# EAGLE design Olimex-MOD-TC-MK2-31855_rev_A1 (EAGLE 6.4)
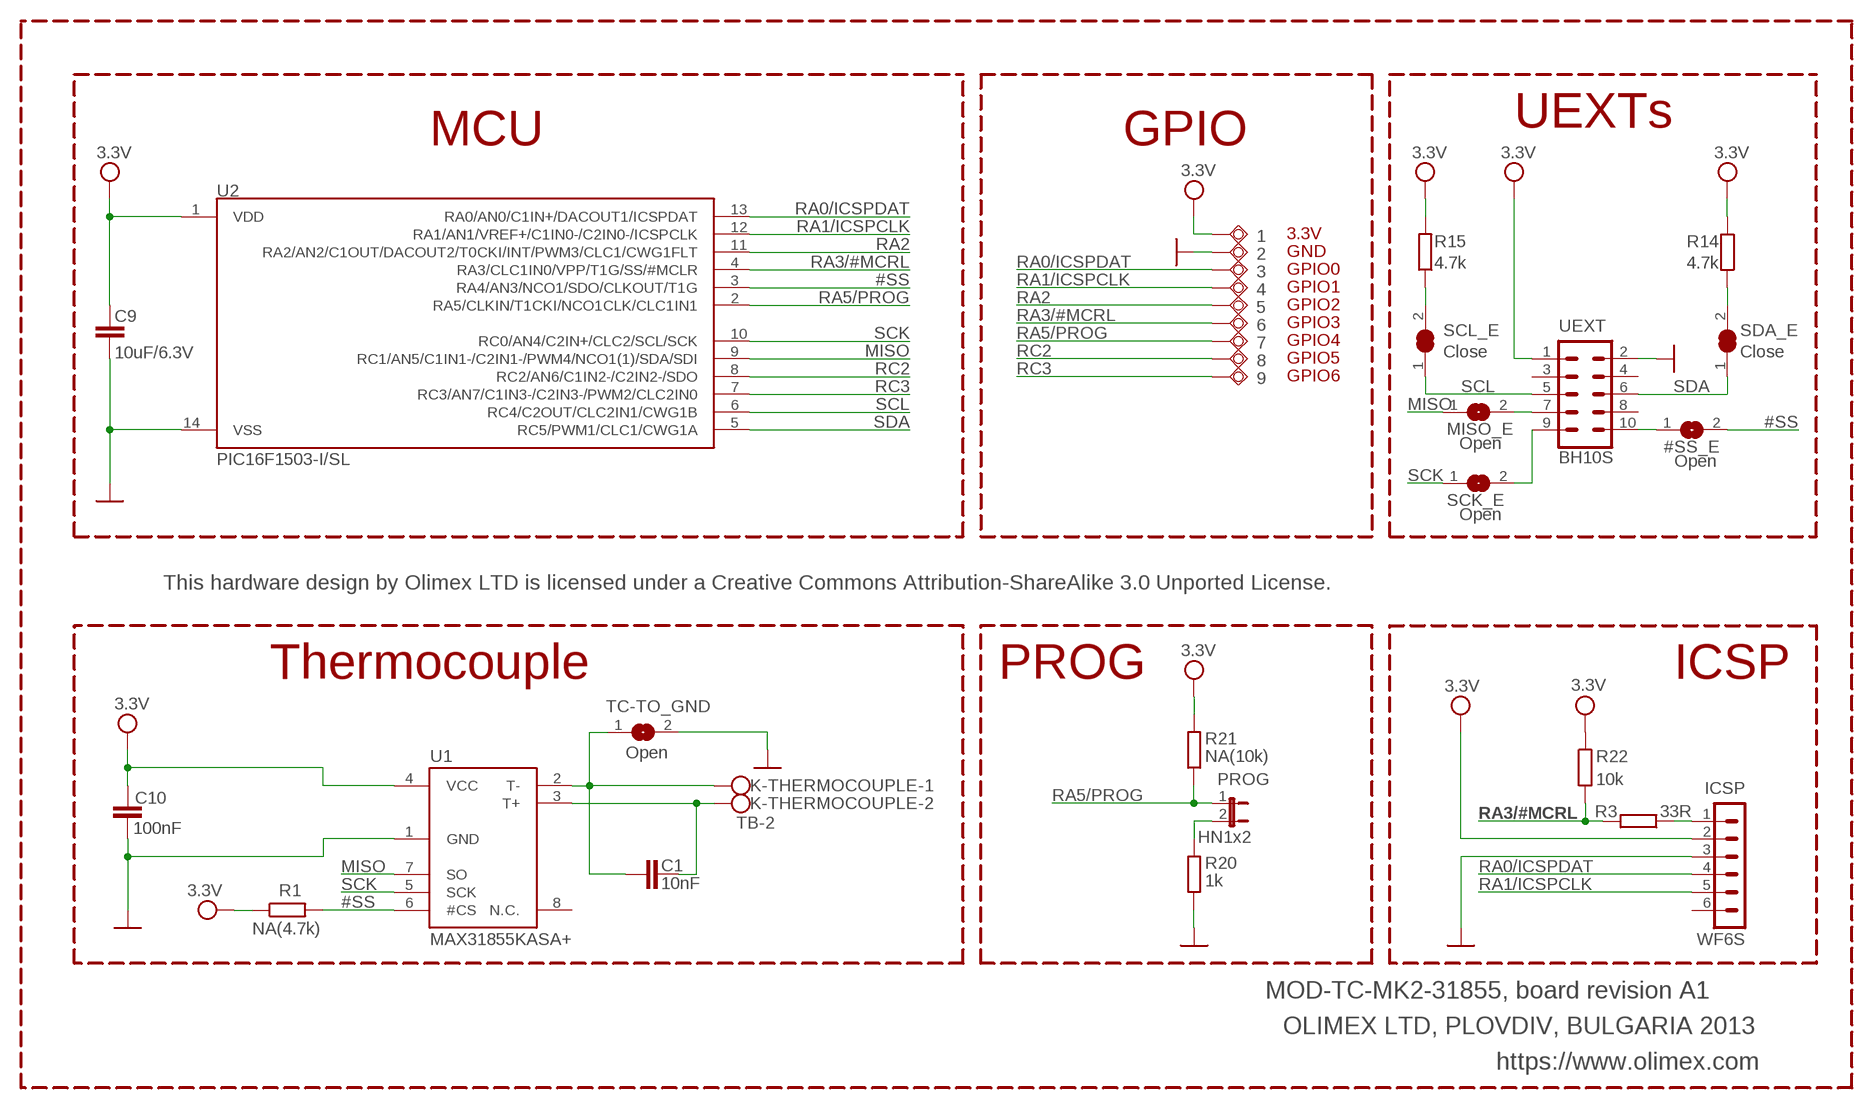
[diagram p0: schematic, sheet 1]

## Parts
1  TESTPAD40/70  [TESTPAD]
2  TESTPAD40/70  [TESTPAD]
3  TESTPAD40/70  [TESTPAD]
4  TESTPAD40/70  [TESTPAD]
5  TESTPAD40/70  [TESTPAD]
6  TESTPAD40/70  [TESTPAD]
7  TESTPAD40/70  [TESTPAD]
8  TESTPAD40/70  [TESTPAD]
9  TESTPAD40/70  [TESTPAD]
#SS_E  Open  SJSJ_SMALLER  [SJ_1_SMALLER]
C1  10nF  C-EUC0603_5MIL  [C0603_5MIL]
C9  10uF/6.3V  C-EUC0603_5MIL  [C0603_5MIL]
C10  100nF  C-EUC0603_5MIL  [C0603_5MIL]
ICSP  WF6S  CON6WF6S  [WF6S]
K-THERMOCOUPLE  TB-2  AK500/2  [AK500/2]
MISO_E  Open  SJSJ_SMALLER  [SJ_1_SMALLER]
PROG  HN1x2  JP1E  [JP1]
R1  NA(4.7k)  R-EU_R0603_5MIL  [R0603_5MIL]
R3  33R  R-EU_R0603_5MIL  [R0603_5MIL]
R14  4.7k  R-EU_R0603_5MIL  [R0603_5MIL]
R15  4.7k  R-EU_R0603_5MIL  [R0603_5MIL]
R20  1k  R-EU_R0603_5MIL  [R0603_5MIL]
R21  NA(10k)  R-EU_R0603_5MIL  [R0603_5MIL]
R22  10k  R-EU_R0603_5MIL  [R0603_5MIL]
SCK_E  Open  SJSJ_SMALLER  [SJ_1_SMALLER]
SCL_E  Close  SJSJ_1_SMALLER_CLOSE  [SJ_1_SMALLER_CLOSE]
SDA_E  Close  SJSJ_1_SMALLER_CLOSE  [SJ_1_SMALLER_CLOSE]
TC-TO_GND  Open  SJSJ_SMALLER  [SJ_1_SMALLER]
U1  MAX31855KASA+  MAX31855  [SO-08]
U2  PIC16F1503-I/SL  PIC16F1503  [SOIC14]
UEXT  BH10S  ML10SMD  [ML10_PADS]

## Nets
#SS: #SS_E.2 R1.2 U1.6(#CS) U2.3(RA4/AN3/NCO1/SDO/CLKOUT/T1G)
GND [PWR]: 2.P$1(PP) C9.2 C10.2 ICSP.3 R20.1 TC-TO_GND.2 U1.1(GND) U2.14(VSS) UEXT.2
MISO: MISO_E.1 U1.7(SO) U2.9(RC1/AN5/C1IN1-/C2IN1-/PWM4/NCO1(1)/SDA/SDI)
N$1: #SS_E.1 UEXT.10
N$2: SCK_E.2 UEXT.9
N$3: MISO_E.2 UEXT.7
N$10: C1.1 K-THERMOCOUPLE.1 TC-TO_GND.1 U1.2(T-)
N$12: C1.2 K-THERMOCOUPLE.2 U1.3(T+)
N$13: ICSP.1 R3.1
N$17: R14.1 SDA_E.2
N$18: R15.1 SCL_E.2
N$19: PROG.2 R20.2
RA0/ICSPDAT: 3.P$1(PP) ICSP.4 U2.13(RA0/AN0/C1IN+/DACOUT1/ICSPDAT)
RA1/ICSPCLK: 4.P$1(PP) ICSP.5 U2.12(RA1/AN1/VREF+/C1IN0-/C2IN0-/ICSPCLK)
RA2: 5.P$1(PP) U2.11(RA2/AN2/C1OUT/DACOUT2/T0CKI/INT/PWM3/CLC1/CWG1FLT)
RA3/#MCRL: 6.P$1(PP) R3.2 R22.2 U2.4(RA3/CLC1IN0/VPP/T1G/SS/#MCLR)
RA5/PROG: 7.P$1(PP) PROG.1 R21.1 U2.2(RA5/CLKIN/T1CKI/NCO1CLK/CLC1IN1)
RC2: 8.P$1(PP) U2.8(RC2/AN6/C1IN2-/C2IN2-/SDO)
RC3: 9.P$1(PP) U2.7(RC3/AN7/C1IN3-/C2IN3-/PWM2/CLC2IN0)
SCK: SCK_E.1 U1.5(SCK) U2.10(RC0/AN4/C2IN+/CLC2/SCL/SCK)
SCL: SCL_E.1 U2.6(RC4/C2OUT/CLC2IN1/CWG1B) UEXT.5
SDA: SDA_E.1 U2.5(RC5/PWM1/CLC1/CWG1A) UEXT.6
VCC: 1.P$1(PP) C9.1 C10.1 ICSP.2 R1.1 R14.2 R15.2 R21.2 R22.1 U1.4(VCC) U2.1(VDD) UEXT.1 ; supply symbol labelled 3.3V
Unconnected: ICSP.6 U1.8(N.C.) UEXT.3 UEXT.4 UEXT.8

## Notes on the sheet
- UEXTs
- MCU | GPIO
- 3.3V
- GND
- GPIO0
- GPIO1
- GPIO2
- GPIO3
- GPIO4
- GPIO5
- GPIO6
- This hardware design by Olimex LTD is licensed under a Creative Commons Attribution-ShareAlike 3.0 Unported License.
- Thermocouple | PROG | ICSP
- MOD-TC-MK2-31855, board revision A1
- OLIMEX LTD, PLOVDIV, BULGARIA 2013
- https://www.olimex.com

## Library data of the parts
1-9 = gogo:TESTPAD: drill 40mils, diameter 70mils
#SS_E MISO_E SCK_E SCL_E SDA_E TC-TO_GND = jumper:SJ: SMD solder JUMPER
C1 C9 C10 = rcl:C-EU: CAPACITOR, European symbol
ICSP = Penko:CON6: CONNECTORS - 6 PINS
K-THERMOCOUPLE = con-ptr500:AK500/2: CONNECTOR
PROG = jumper:JP1E: JUMPER
R1 R3 R14 R15 R20-R22 = rcl:R-EU_: RESISTOR, European symbol
U1 = OLIMEX_IC:MAX31855
U2 = OLIMEX_IC:PIC16F1503
UEXT = con-harting-ml:ML10: HARTING

## Net classes
1 PWR: width 0.203 mm, drill 0.4 mm, clearance 0.076 mm

## Board
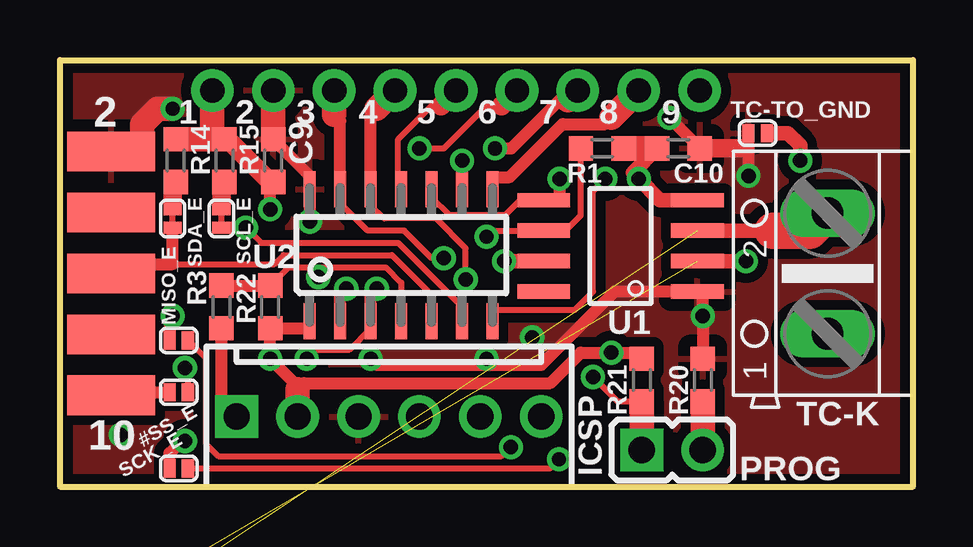
[diagram p1: board, top side]
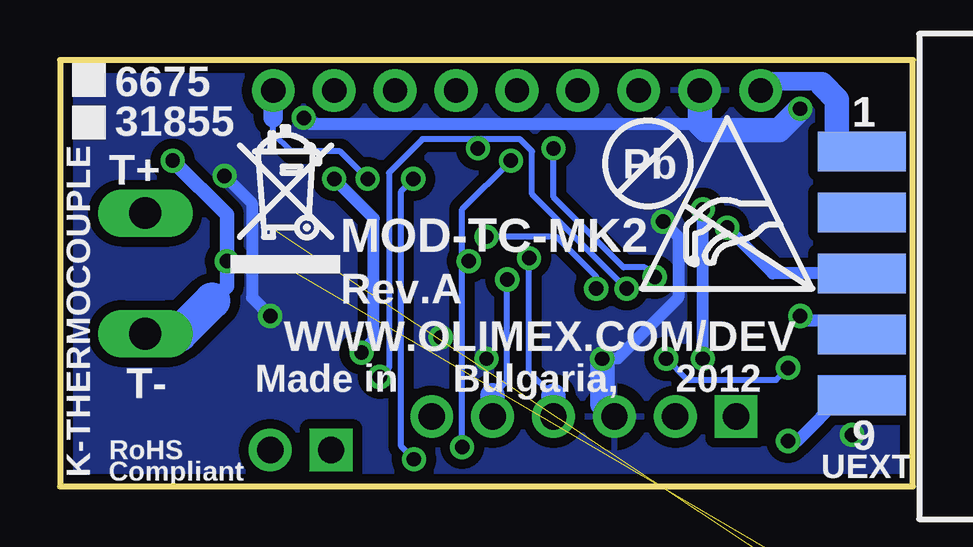
[diagram p2: board, bottom side, seen from below]

Size 35.56 x 17.78 mm. Coordinates in mm from the lower left corner, seen from the top.
Outline: 0,0 35.56,0 35.56,17.78 0,17.78 0,0
Copper layers (1+16): Top 0.035mm / dielectric 1.5mm / Bottom 0.035mm
Design rules "default": minimum track width 8mil, minimum drill 15mil, track to track 8mil, track to pad 8mil, pad to pad 8mil, via to via 8mil, smd to smd 1mil, copper to edge 10mil, drill to drill 8mil, minimum pad ring 10mil, minimum via ring 8mil, stop-mask expansion 4mil, vias tented up to drill 25mil, thermal gap 20mil

### Footprints (pad centres in the part's own frame; a part is rotated, then mirrored left to right if it is on the bottom)
TESTPAD = drill 1.016 pad 1.778: P$1 0,0
SJ_1_SMALLER = smd 0.508 x 0.762: 1 -0.381,0; 2 0.381,0
C0603_5MIL = smd 1.016 x 1.016: 1 -0.889,0; 2 0.889,0
WF6S = drill 1.1 pad 1.778 square: 1 -6.35,0 | drill 1.1 pad 1.778: 2 -3.81,0; 3 -1.27,0; 4 1.27,0; 5 3.81,0; 6 6.35,0
AK500/2 = drill 1.321 long: 1 -2.515,0; 2 2.515,0
JP1 = drill 1.1 pad 1.778 square: 1 0,-1.27 | drill 1.1 pad 1.778: 2 0,1.27
R0603_5MIL = smd 1.016 x 1.016: 1 -0.889,0; 2 0.889,0
SJ_1_SMALLER_CLOSE = smd 0.508 x 0.762: 1 -0.381,0; 2 0.381,0
SO-08 = smd 0.6 x 2.2: 1 -1.905,-3.2; 2 -0.635,-3.2; 3 0.635,-3.2; 4 1.905,-3.2; 5 1.905,3.2; 6 0.635,3.2; 7 -0.635,3.2; 8 -1.905,3.2
SOIC14 = smd 0.5 x 1.5: 1 -3.81,-2.75; 2 -2.54,-2.75; 3 -1.27,-2.75; 4 0,-2.75; 5 1.27,-2.75; 6 2.54,-2.75; 7 3.81,-2.75; 8 3.81,2.75; 9 2.54,2.75; 10 1.27,2.75; 11 0,2.75; 12 -1.27,2.75; 13 -2.54,2.75; 14 -3.81,2.75
ML10_PADS = smd 1.651 x 3.683: 1 -5.08,-0.229; 3 -2.54,-0.229; 5 0,-0.229; 7 2.54,-0.229; 9 5.08,-0.229 | smd 1.651 x 3.683 bottom: 2 -5.08,-0.229; 4 -2.54,-0.229; 6 0,-0.229; 8 2.54,-0.229; 10 5.08,-0.229

### Placement (x,y rotation side)
1  6.35,16.51 0 top
2  8.89,16.51 0 top
3  11.43,16.51 0 top
4  13.97,16.51 0 top
5  16.51,16.51 0 top
6  19.05,16.51 0 top
7  21.59,16.51 0 top
8  24.13,16.51 0 top
9  26.67,16.51 0 top
#SS_E  4.95,3.94 0 top
C1  not placed on the board
C9  8.89,13.59 90 top
C10  25.78,14.1 0 top
ICSP  13.72,2.92 0 top
K-THERMOCOUPLE  32,8.89 90 top
MISO_E  4.95,6.1 180 top
PROG  25.53,1.52 270 top
R1  22.61,14.1 180 top
R3  6.73,7.49 90 top
R14  4.83,13.59 90 top
R15  6.86,13.59 90 top
R20  26.8,4.45 270 top
R21  24.26,4.45 90 top
R22  8.76,7.49 90 top
SCK_E  4.95,0.76 180 top
SCL_E  6.73,11.18 90 top
SDA_E  4.7,11.18 90 top
TC-TO_GND  29.08,14.73 180 top
U1  23.37,10.03 90 top
U2  14.22,9.65 0 top
U$1  [ESD_SYMBOL]  11.3,8.26 0 bottom
U$6  [RECYCLE_BIN1/8]  28.45,8.89 0 bottom
U$7  [PB_SMALL]  11.05,13.46 0 bottom
UEXT  1.91,8.89 270 bottom

### Tracks (layer width: path | path; a pad name or v marks a point on that pad's centre or on a via)
#SS  (via drill 0.6)
  Top 0.254: R1.2 21.72,11.3 21.08,10.67 U1.6 18.03,10.67 v17.78,10.41 | 12.95,6.6 12.06,5.71 10.67,5.71 v10.29,5.33 | #SS_E.2 5.33,4.83 v5.21,4.95
  Top 0.406: 12.95,6.6 U2.3
  Top 0.508: U2.3 12.95,8 v13.21,8.26
  Bottom 0.254: v13.21,8.26 13.21,8.76 14.86,10.41 v17.78,10.41 | v5.21,4.95 5.71,4.45 9.4,4.45 v10.29,5.33
GND  (via drill 0.6)
  Top 0.508: 28.57,14.1 28.7,14.1 | v12.95,5.33 13.21,5.08 20.07,5.08 23.11,8.13 U1.1 26.8,8.13 v26.8,7.11 R20.1 | 28.7,14.1 TC-TO_GND.2 | 28.7,14.1 v28.7,12.95 | v25.4,15.37 C10.2 | 10.41,12.42 v10.41,11.05 | 10.41,12.42 U2.14 | 10.41,12.42 10.41,12.95 C9.2
  Top 0.762: C10.2 28.57,14.1
  Top 1.016: 2.P$1 C9.2 | UEXT.2 3.43,13.97 3.43,15.11 4.06,15.75 v4.7,15.75
  Bottom 0.508: v28.7,12.95 27.56,11.81 27.56,7.87 v26.8,7.11 | 8.89,15.11 25.15,15.11 v25.4,15.37 | v10.41,11.05 9.78,10.41 9.78,7.87 12.32,5.33 v12.95,5.33
  Bottom 1.016: v12.95,5.33 12.95,3.43 ICSP.3 | 2.P$1 8.89,15.11 8.64,14.86 5.59,14.86 v4.7,15.75
  other vias: 17.78,5.33 2.54,2.16 19.68,6.22
  pour Bottom (isolate 0.406, rank 2): -5.08,-5.08 40.64,-5.08 40.64,22.86 -5.08,22.86
  pour Top (isolate 0.406, rank 2): -2.54,-2.54 38.1,-2.54 38.1,20.32 -2.54,20.32
MISO  (via drill 0.6)
  Top 0.254: v18.8,1.65 18.41,1.27 6.6,1.27 6.1,1.78 6.1,5.33 MISO_E.1 | v16.76,13.59 U2.9
  Top 0.61: v18.52,9.4 U1.7
  Bottom 0.254: v18.8,1.65 18.8,9.4 | 18.8,9.4 v18.52,9.4 | 18.8,9.4 18.8,11.56 v16.76,13.59
N$1
  Top 0.508: UEXT.10 2.26,3.94 #SS_E.1
N$2  (via drill 0.6)
  Top 0.508: v5.21,1.91 5.08,1.91 4.57,1.4 SCK_E.2
  Bottom 0.508: UEXT.9 2.92,3.81 4.83,1.91 v5.21,1.91
N$3  (via drill 0.6)
  Top 0.508: MISO_E.2 4.57,6.99 v4.7,7.11
  Bottom 0.508: UEXT.7 2.69,6.91 4.5,6.91 v4.7,7.11
N$10  (via drill 0.6)  (1 unrouted)
  Top 0.508: 29.59,14.73 TC-TO_GND.1
  Top 0.61: U1.2 v28.6,9.4 | 29.59,14.73 30.35,14.73 30.86,14.22 v30.86,13.59
  Bottom 0.61: v30.86,13.59 28.6,11.33 v28.6,9.4 28.6,8.36 29.21,7.75
  Bottom 1.524: K-THERMOCOUPLE.1 30.58,6.38 29.21,7.75
N$12  (1 unrouted)
  Top 0.61: U1.3 29.72,10.67
  Top 1.524: K-THERMOCOUPLE.2 31.27,10.67 29.72,10.67
N$13
  Top 0.508: 6.99,3.3 6.73,3.56 R3.1
  Top 1.016: ICSP.1 6.99,3.3
N$17
  Top 0.508: SDA_E.2 4.7,11.68
  Top 0.762: 4.7,11.68 4.7,12.57 R14.1
N$18
  Top 0.508: SCL_E.2 6.73,11.68
  Top 0.762: 6.73,11.68 6.73,12.57 R15.1
N$19
  Top 1.016: PROG.2 R20.2
RA0/ICSPDAT  (via drill 0.6)
  Top 0.254: U2.13 11.68,11.81 12.83,10.67 14.35,10.67 15.49,9.53 v16,9.53
  Top 0.508: U2.13 11.68,15.24 11.43,15.49
  Top 1.016: 11.43,15.49 3.P$1
  Bottom 0.254: 14.99,3.79 16,4.8 v16,9.53
  Bottom 1.016: ICSP.4 14.99,3.79
RA1/ICSPCLK  (via drill 0.6)
  Top 0.254: v16.92,8.64 16.92,9.93 15.67,11.18 13.51,11.18 12.95,11.73 U2.12
  Top 0.508: U2.12 12.95,15.49 13.21,15.75
  Top 1.016: 13.21,15.75 4.P$1
  Bottom 0.254: 17.53,3.81 16.92,4.42 v16.92,8.64
  Bottom 1.016: ICSP.5 17.53,3.81
RA2
  Top 0.254: U2.11 14.1,12.53 14.1,14.48 15.49,15.88 15.88,15.88
  Top 0.813: 15.88,15.88 5.P$1
RA3/#MCRL  (via drill 0.6)
  Top 0.254: 10.77,9.14 9.53,9.14 R22.2 | 10.77,9.14 v10.77,8.74 | 10.77,9.14 13.59,9.14 14.22,8.51 U2.4 | v14.99,14.1 16,14.1 17.78,15.88 18.41,15.88
  Top 0.508: R3.2 R22.2
  Top 0.813: 18.41,15.88 6.P$1
  Bottom 0.254: v10.77,8.74 11.18,9.14 12.06,9.14 14.99,12.06 v14.99,14.1
RA5/PROG  (via drill 0.6)
  Top 0.254: v22.23,4.57 23.24,3.56 R21.1
  Top 0.508: v18.14,14.1 18.82,14.1 20.83,16.1 21.18,16.1 | U2.2 11.68,8 v11.94,8.26
  Top 1.016: 21.18,16.1 7.P$1 | R21.1 PROG.1
  Bottom 0.254: 18.14,14.48 20.45,14.48 21.84,13.08 21.84,4.95 v22.23,4.57 | v11.94,8.26 15.88,12.19 15.88,13.97 16.38,14.48 18.14,14.48 | 18.14,14.48 v18.14,14.1
RC2
  Top 0.508: 22.99,15.37 22.73,15.11 20.95,15.11 18.75,12.9 18.19,12.9 18.03,12.75 U2.8
  Top 1.016: 22.99,15.37 8.P$1
RC3  (via drill 0.6)
  Top 0.254: U2.7 18.03,7.37 21.46,7.37 22.23,8.13 22.23,12.32 v22.73,12.83
  Bottom 0.254: v22.73,12.83 23.88,13.97 25.91,13.97 26.67,14.73 26.67,15.37
  Bottom 0.813: 26.67,15.37 9.P$1
SCK  (via drill 0.6)
  Top 0.254: SCK_E.1 20.42,0.76 v20.8,1.14 | U2.10 15.49,12.06 16.26,11.3 18.54,11.3 19.18,11.94 U1.5
  Top 0.508: U1.5 20.7,11.94 20.83,12.06 v20.83,12.83
  Bottom 0.254: v20.8,1.14 21.34,1.68 21.34,12.32 v20.83,12.83
SCL  (via drill 0.6)
  Top 0.254: v7.75,10.79 8.38,10.16 14.1,10.16 16.76,7.49 U2.6
  Top 0.508: v7.75,10.79 SCL_E.1
  Bottom 0.508: UEXT.5 5.84,8.89 v7.75,10.79
SDA
  Top 0.254: U2.5 15.49,8 13.84,9.65 9.32,9.65 8.94,9.27 4.7,9.27
  Top 0.508: SDA_E.1 4.7,9.27 3.5,9.27 3.12,8.89 UEXT.6
VCC  (via drill 0.6)
  Top 0.508: U2.1 10.41,6.6 R22.1 v8.76,5.33 9.91,4.19 9.91,4.06 10.16,4.32 20.45,4.32 21.72,5.59 v22.99,5.59 24,5.59 R21.2 | 6.99,14.48 R15.2 | 8.76,12.7 C9.1 8.76,12.57 v8.76,11.56
  Top 0.61: U1.4 25.02,11.94 v24.13,12.83 23.88,13.08 C10.1
  Top 0.762: 8.76,12.7 6.99,14.48
  Top 1.016: 6.35,14.48 R14.2 | R15.2 6.35,14.48 | 6.35,14.48 1.P$1 | C10.1 R1.1 | ICSP.2 9.91,4.06
  Bottom 0.508: v22.99,5.59 22.48,6.1 22.48,11.18 v24.13,12.83 | v8.76,5.33 v8.76,11.56
  Bottom 0.762: 6.1,16.76 5.97,16.89 3.94,16.89 3.81,16.76
  Bottom 1.016: UEXT.1 2.79,13.97 3.17,14.35 3.17,16.13 3.81,16.76 | 1.P$1 6.1,16.76

### Text on the board
tNames: TC-K
bNames: 6675 | 31855 | T+ | MOD-TC-MK2 | Rev.A | WWW.OLIMEX.COM/DEV | T- | 2012 | Bulgaria, | Made in | RoHS | Compliant